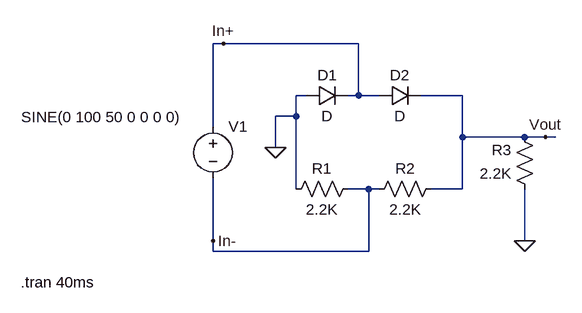
[diagram p0: schematic 1.asc]
1.asc, the LTspice schematic file:
Version 4.1
SHEET 1 880 680
WIRE 0 0 -16 0
WIRE 208 0 0 0
WIRE 128 80 112 80
WIRE 208 80 208 0
WIRE 208 80 192 80
WIRE 240 80 208 80
WIRE 368 80 304 80
WIRE 112 112 112 80
WIRE 112 112 80 112
WIRE -16 128 -16 0
WIRE 368 144 368 80
WIRE 464 144 368 144
WIRE 496 144 464 144
WIRE 512 144 496 144
WIRE 80 160 80 112
WIRE 112 224 112 112
WIRE 224 224 192 224
WIRE 240 224 224 224
WIRE 368 224 368 144
WIRE 368 224 320 224
WIRE -16 304 -16 208
WIRE 464 304 464 224
WIRE -16 320 -16 304
WIRE 224 320 224 224
WIRE 224 320 -16 320
FLAG 80 160 0
FLAG 464 304 0
FLAG 0 0 In+
FLAG -16 304 In-
FLAG 496 144 Vout
SYMBOL voltage -16 112 R0
WINDOW 3 -295 1 Left 2
WINDOW 123 0 0 Left 0
WINDOW 39 0 0 Left 0
SYMATTR InstName V1
SYMATTR Value SINE(0 100 50 0 0 0 0)
SYMBOL diode 128 96 R270
WINDOW 0 32 32 VTop 2
WINDOW 3 0 32 VBottom 2
SYMATTR InstName D1
SYMBOL diode 240 96 R270
WINDOW 0 32 32 VTop 2
WINDOW 3 0 32 VBottom 2
SYMATTR InstName D2
SYMBOL res 208 208 R90
WINDOW 0 0 56 VBottom 2
WINDOW 3 32 56 VTop 2
SYMATTR InstName R1
SYMATTR Value 2.2K
SYMBOL res 336 208 R90
WINDOW 0 0 56 VBottom 2
WINDOW 3 32 56 VTop 2
SYMATTR InstName R2
SYMATTR Value 2.2K
SYMBOL res 480 240 R180
WINDOW 0 36 76 Left 2
WINDOW 3 36 40 Left 2
SYMATTR InstName R3
SYMATTR Value 2.2K
TEXT -312 368 Left 2 !.tran 40ms

The netlist it stands for:
* 1.asc
V1 In+ In- SINE(0 100 50 0 0 0 0)
D1 0 In+ D
D2 In+ Vout D
R1 In- 0 2.2K
R2 Vout In- 2.2K
R3 0 Vout 2.2K
.model D D
.lib standard.dio
.tran 40ms
.backanno
.end